# EAGLE design Remote_V1 (EAGLE 8.0.0)
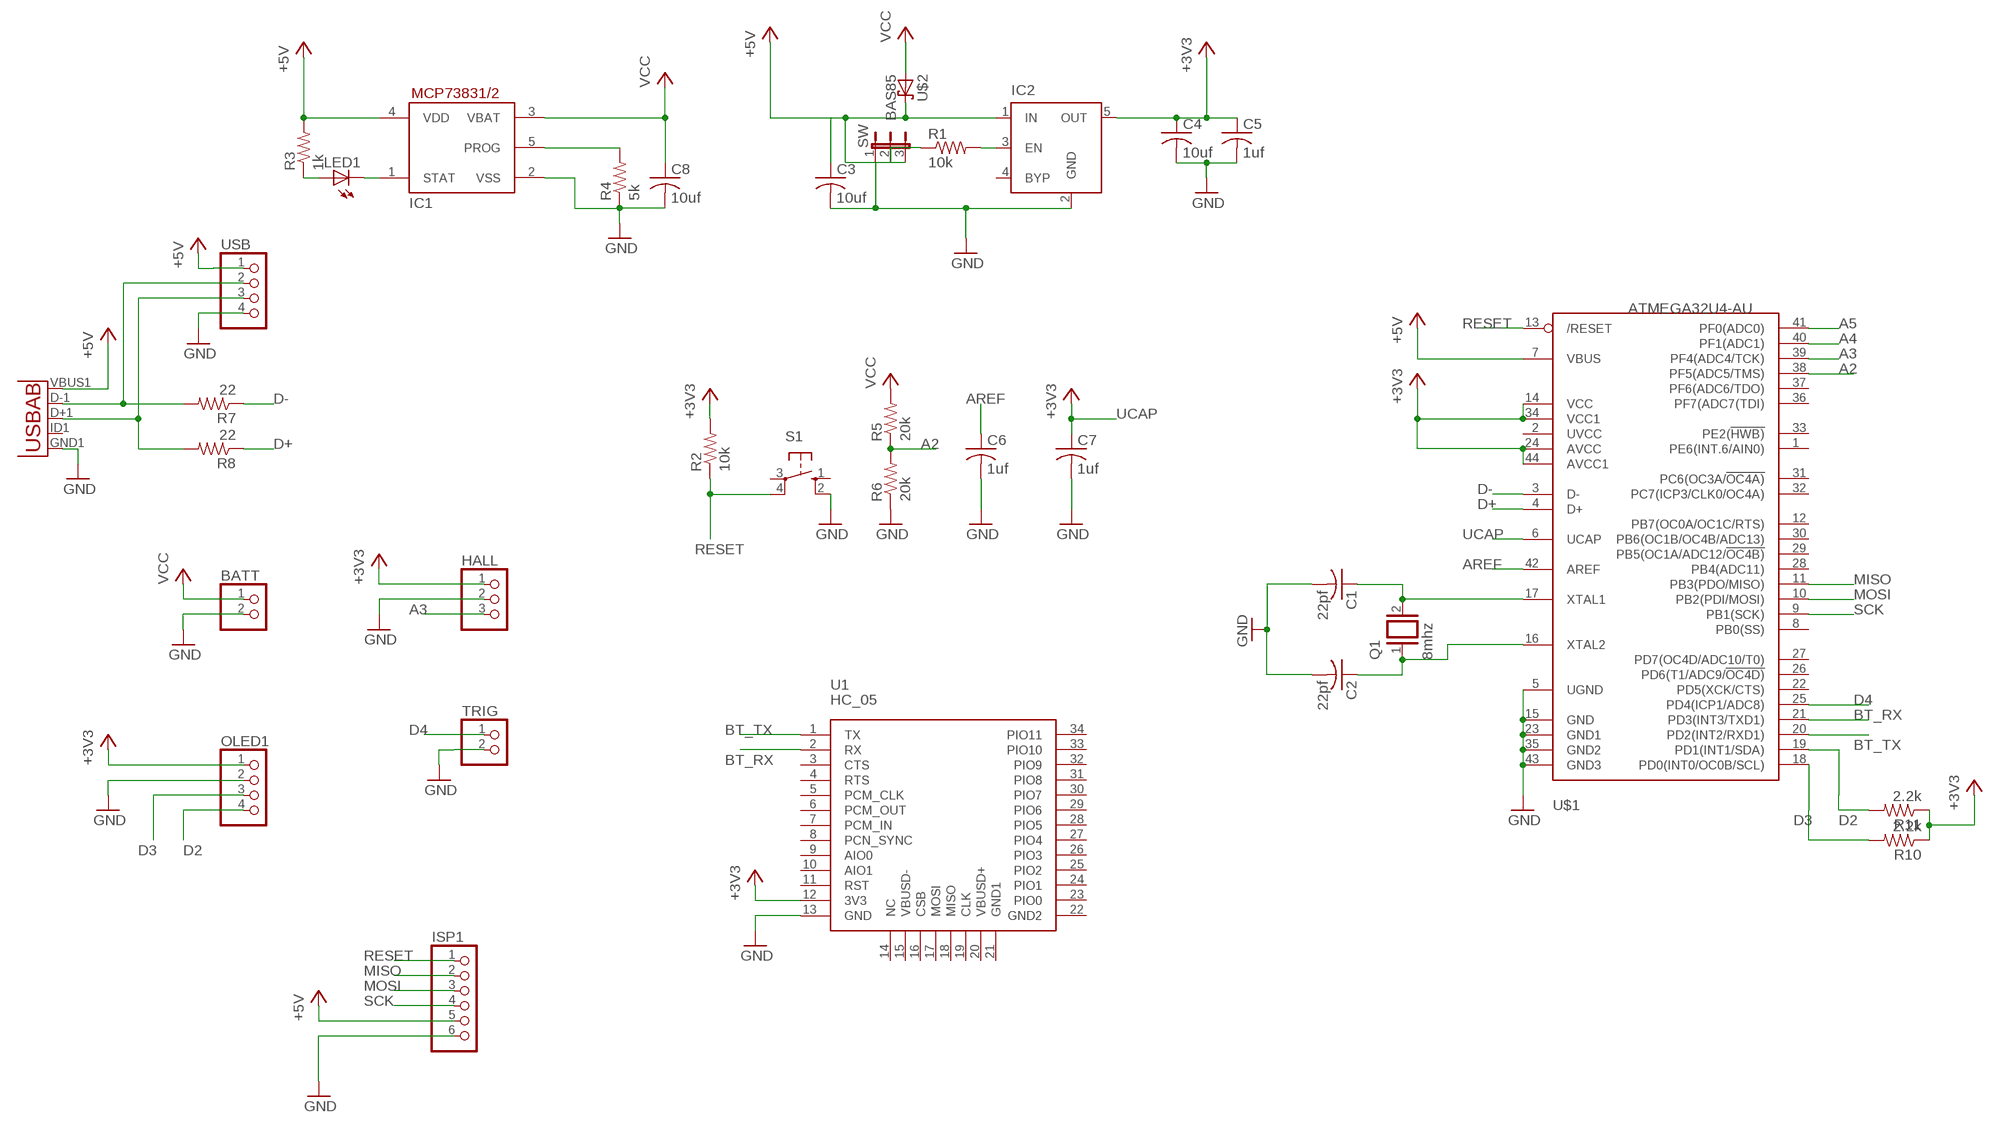
[diagram p0: schematic, sheet 1]

## Parts
BATT  PINHD-1X2  [1X02]
C1  22pf  C-US025-030X050  [C025-030X050]
C2  22pf  C-US025-030X050  [C025-030X050]
C3  10uf  C-USC0603  [C0603]
C4  10uf  C-USC0603  [C0603]
C5  1uf  C-USC0603  [C0603]
C6  1uf  C-USC0603  [C0603]
C7  1uf  C-USC0603  [C0603]
C8  10uf  C-USC0603  [C0603]
HALL  PINHD-1X3  [1X03]
IC1  MCP73831/OT  [SOT23-5L]
IC2  MIC5219XX  [SOT23-5]
ISP1  PINHD-1X6  [1X06]
LED1  LEDCHIPLED_0805  [CHIPLED_0805]
OLED1  PINHD-1X4  [1X04]
Q1  8mhz  XTAL/S  [QS]
R1  10k  R-US_R0603  [R0603]
R2  10k  R-US_R0603  [R0603]
R3  1k  R-US_R0603  [R0603]
R4  5k  R-US_R0603  [R0603]
R5  20k  R-US_R0603  [R0603]
R6  20k  R-US_R0603  [R0603]
R7  22  R-US_R0603  [R0603]
R8  22  R-US_R0603  [R0603]
R10  2.2k  R-US_R0603  [R0603]
R11  2.2k  R-US_R0603  [R0603]
S1  10-XX  [B3F-10XX]
SW  JP2E  [JP2]
TRIG  PINHD-1X2  [1X02]
U1  HC_05  [BLUETOOTH_SMD]
U2  USB""  [USB-MICRO-SMD]
U$1  ATMEGA32U4-AU  [TQFP44]
U$2  BAS85  [SOD80C]
USB  PINHD-1X4  [1X04]

## Nets
+3V3 [V3.3]: C4.1 C5.1 HALL.1 IC2.5(OUT) OLED1.1 R2.2 R10.1 R11.1 U1.12(3V3) U$1.14(VCC) U$1.24(AVCC) U$1.34(VCC1) U$1.44(AVCC1)
+5V [Vbus]: C3.1 IC1.4(VDD) IC2.1(IN) ISP1.5 R3.2 SW.3 U2.VBUS1(VBUS) U$1.7(VBUS) U$2.1(K) USB.1
A2: R5.1 R6.2 U$1.38(PF5(ADC5/TMS))
A3: HALL.3 U$1.39(PF4(ADC4/TCK))
A4: U$1.40(PF1(ADC1))
A5: U$1.41(PF0(ADC0))
AREF: C6.1 U$1.42(AREF)
BT_RX: U1.2(RX) U$1.21(PD3(INT3/TXD1))
BT_TX: U1.1(TX) U$1.20(PD2(INT2/RXD1))
D2: OLED1.4 R11.2 U$1.19(PD1(INT1/SDA))
D3: OLED1.3 R10.2 U$1.18(PD0(INT0/OC0B/SCL))
D4: TRIG.1 U$1.25(PD4(ICP1/ADC8))
D+: R8.1 U$1.4(D+)
D-: R7.1 U$1.3(D-)
GND [GND]: BATT.2 C1.2 C2.2 C3.2 C4.2 C5.2 C6.2 C7.2 C8.2 HALL.2 IC1.2(VSS) IC2.2(GND) ISP1.6 OLED1.2 R4.1 R6.1 S1.2(S1) SW.1 TRIG.2 U1.13(GND) U2.GND1(GND) U$1.5(UGND) U$1.15(GND) U$1.23(GND1) U$1.35(GND2) U$1.43(GND3) USB.4
MISO: ISP1.2 U$1.11(PB3(PDO/MISO))
MOSI: ISP1.3 U$1.10(PB2(PDI/MOSI))
N$1: C1.1 Q1.2 U$1.17(XTAL1)
N$2: C2.1 Q1.1 U$1.16(XTAL2)
N$3: R1.1 SW.2
N$4: IC2.3(EN) R1.2
N$5: LED1.A R3.1
N$6: IC1.1(STAT) LED1.C
N$7: IC1.5(PROG) R4.2
N$11: R7.2 U2.D-1(D-) USB.2
N$12: R8.2 U2.D+1(D+) USB.3
RESET: ISP1.1 R2.1 S1.4(P1) U$1.13(/RESET)
SCK: ISP1.4 U$1.9(PB1(SCK))
UCAP: C7.1 U$1.6(UCAP) ; supply symbol labelled +3V3
VCC [Vbat]: BATT.1 C8.1 IC1.3(VBAT) R5.2 U$2.2(A)
Unconnected: IC2.4(BYP) S1.1(S) S1.3(P) U1.3(CTS) U1.4(RTS) U1.5(PCM_CLK) U1.6(PCM_OUT) U1.7(PCM_IN) U1.8(PCN_SYNC) U1.9(AIO0) U1.10(AIO1) U1.11(RST) U1.14(NC) U1.15(VBUSD-) U1.16(CSB) U1.17(MOSI) U1.18(MISO) U1.19(CLK) U1.20(VBUSD+) U1.21(GND1) U1.22(GND2) U1.23(PIO0) U1.24(PIO1) U1.25(PIO2) U1.26(PIO3) U1.27(PIO4) U1.28(PIO5) U1.29(PIO6) U1.30(PIO7) U1.31(PIO8) U1.32(PIO9) U1.33(PIO10) U1.34(PIO11) U2.ID1(USBID) U$1.1(PE6(INT.6/AIN0)) U$1.2(UVCC) U$1.8(PB0(SS)) U$1.12(PB7(OC0A/OC1C/RTS)) U$1.22(PD5(XCK/CTS)) U$1.26(PD6(T1/ADC9/!OC4D)) U$1.27(PD7(OC4D/ADC10/T0)) U$1.28(PB4(ADC11)) U$1.29(PB5(OC1A/ADC12/!OC4B)) U$1.30(PB6(OC1B/OC4B/ADC13)) U$1.31(PC6(OC3A/!OC4A)) U$1.32(PC7(ICP3/CLK0/OC4A)) U$1.33(PE2(!HWB)) U$1.36(PF7(ADC7(TDI)) U$1.37(PF6(ADC6/TDO))

## Library data of the parts
BATT TRIG = pinhead:PINHD-1X2: PIN HEADER
C1-C8 = adafruit:C-US: CAPACITOR, American symbol
HALL = pinhead:PINHD-1X3: PIN HEADER
IC1 = adafruit:MCP73831: MCP73831/2 Miniature Single-Cell, Fully Integrated Li-Ion, Li-Polymer Charge Management Controllers. Nice and small simple lipoly charge controller, with adjustable current and status output (LED) http://www.ladyada.net/library/pcb/eaglelibrary.html
IC2 = v-reg-micrel:MIC5219XX: VOLTAGE REGULATOR; OC_FARNELL: unknown; OC_NEWARK: unknown
ISP1 = adafruit:PINHD-1X6: PIN HEADER
LED1 = adafruit:LED: LED OSRAM: - CHIPLED LG R971, LG N971, LY N971, LG Q971, LY Q971, LO R971, LY R971 LH N974, LH R974 LS Q976, LO Q976, LY Q976 LO Q996 - Hyper CHIPLED LW Q18S LB Q993, LB Q99A, LB R99A - SideLED LS A670, LO A670, LY A670, LG A670, LP A670 LB A673, LV A673, LT A673, LW A673 LH A674 LY A675 LS A676, LA A676, LO A676, LY A676, LW A676 LS A679, LY A679, LG A679 - Hyper Micro SIDELED® LS Y876, LA Y876, LO Y876, LY Y876 LT Y87S - SmartLED LW L88C, LW L88S LB L89C, LB L89S, LG L890 LS L89K, LO L89K, LY L89K LS L896, LA L896, LO L896, LY L896 - TOPLED LS T670, LO T670, LY T670, LG T670, LP T670 LSG T670, LSP T670, LSY T670, LOP T670, LYG T670 LG T671, LOG T671, LSG T671 LB T673, LV T673, LT T673, LW T673 LH T674 LS T676, LA T676, LO T676, LY T676, LB T676, LH T676, LSB T676, LW T676 LB T67C, LV T67C, LT T67C, LS T67K, LO T67K, LY T67K, LW E67C LS E67B, LA E67B, LO E67B, LY E67B, LB E67C, LV E67C, LT E67C LW T67C LS T679, LY T679, LG T679 LS T770, LO T770, LY T770, LG T770, LP T770 LB T773, LV T773, LT T773, LW T773 LH T774 LS E675, LA E675, LY E675, LS T675 LS T776, LA T776, LO T776, LY T776, LB T776 LHGB T686 LT T68C, LB T68C - Hyper Mini TOPLED® LB M676 - Mini TOPLED Santana® LG M470 LS M47K, LO M47K, LY M47K Source: http://www.osram.convergy.de/
OLED1 USB = pinhead:PINHD-1X4: PIN HEADER
Q1 = special:XTAL/S: CRYSTAL
R1-R8 R10 R11 = resistor:R-US_: RESISTOR, American symbol
S1 = switch-omron:10-XX: OMRON SWITCH; MPN: B3F-1000; OC_FARNELL: 176432; OC_NEWARK: 36M3542
SW = jumper:JP2E: JUMPER
U1 = SparkFun-RF:HC_05: HC-05 Bluetooth Module
U2 = microUSB:USB: This is a USB AB connector that is compatible with USB OTG. i.e. this connector can serve as a host or device
U$1 = adafruit:ATMEGA32U4: http://www.ladyada.net/library/eagle
U$2 = nxp_60:BAS85: Schottky barrier diode Planar Schottky barrier diode with an integrated guard ring for stress protection, encapsulated in a small hermetically sealed glass SOD80C Surface-Mounted Device SMD package with tin-plated metal discs at each end. It is suitable for ?automatic placement? and as such it can withstand immersion soldering. AAL Eindhoven MK

## Net classes
1 Vbus: width 0.508 mm
2 Vbat: width 0.508 mm
3 V3.3: width 0.508 mm
4 GND: width 0.508 mm

## Board
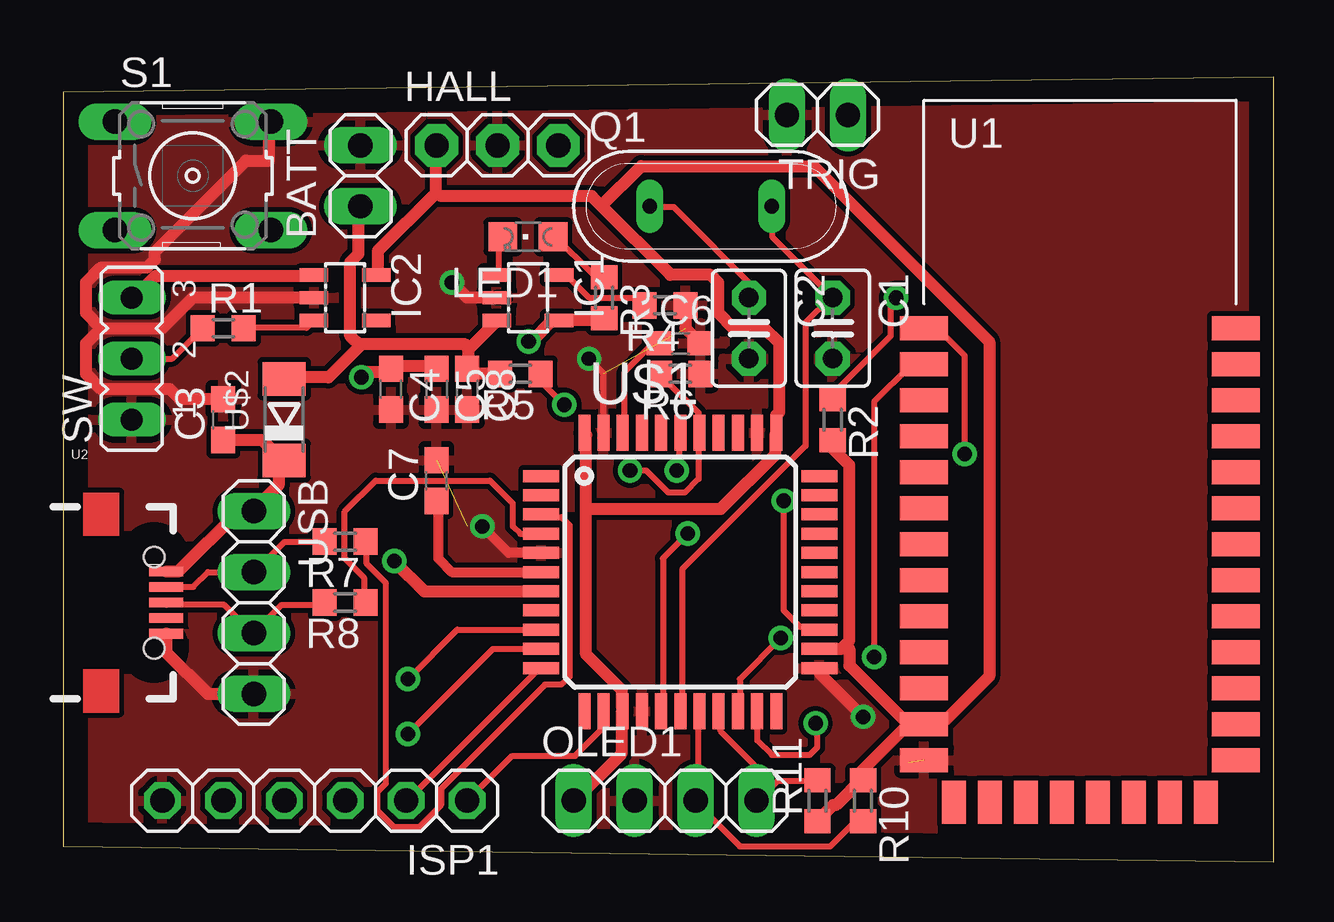
[diagram p1: board, top side]
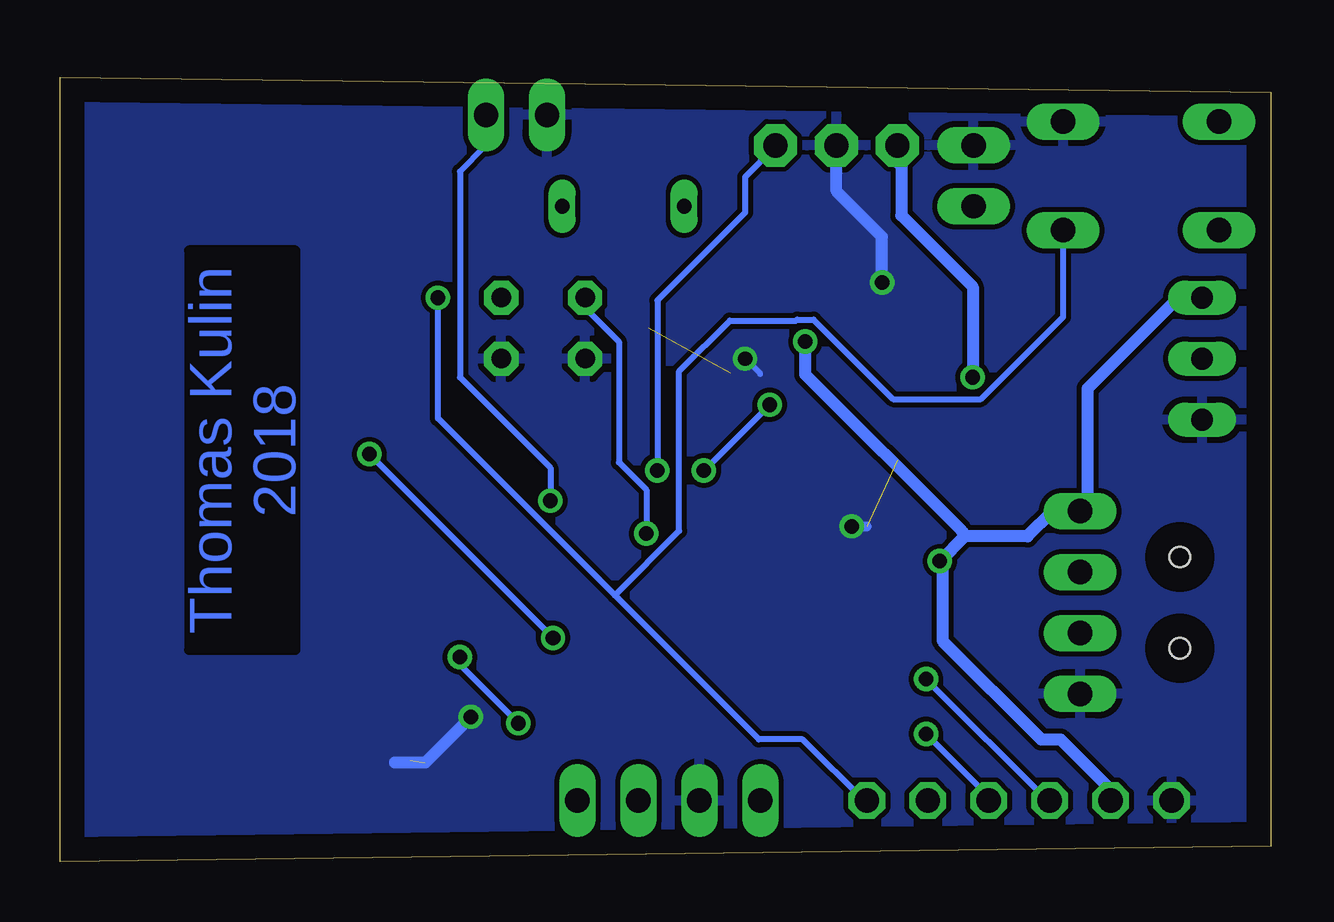
[diagram p2: board, bottom side, seen from below]

Size 50.46 x 32.69 mm. Coordinates in mm from the lower left corner, seen from the top.
Outline: 0,0.64 50.46,0 50.46,32.69 0,32.05 0,0.64
Copper layers (1*16): Top 0.035mm / dielectric 1.5mm / Bottom 0.035mm
Design rules "default": minimum track width 10mil, minimum drill 24mil, track to track 8mil, track to pad 8mil, pad to pad 8mil, via to via 8mil, smd to smd 8mil, copper to edge 40mil, drill to drill 8mil, minimum pad ring 10mil, minimum via ring 8mil, stop-mask expansion 4mil, vias tented up to drill 0mil, thermal gap 10mil

### Footprints (pad centres in the part's own frame; a part is rotated, then mirrored left to right if it is on the bottom)
1X02 = drill 1.016 long: 1 -1.27,0; 2 1.27,0
C025-030X050 = drill 0.813 pad 1.422 octagon: 1 -1.27,0; 2 1.27,0
C0603 = smd 1.1 x 1: 1 -0.85,0; 2 0.85,0
1X03 = drill 1.016 pad 1.778 octagon: 1 -2.54,0; 2 0,0; 3 2.54,0
SOT23-5L = smd 0.55 x 1.2: 1 -0.95,-1.3; 2 0,-1.3; 3 0.95,-1.3; 4 0.95,1.3; 5 -0.95,1.3
SOT23-5 = smd 0.55 x 1.2: 1 -0.95,-1.3; 2 0,-1.3; 3 0.95,-1.3; 4 0.95,1.3; 5 -0.95,1.3
1X06 = drill 1.016 octagon: 1 -6.35,0; 2 -3.81,0; 3 -1.27,0; 4 1.27,0; 5 3.81,0; 6 6.35,0
CHIPLED_0805 = smd 1.2 x 1.2: A 0,-1.05; C 0,1.05
1X04 = drill 1.016 long: 1 -3.81,0; 2 -1.27,0; 3 1.27,0; 4 3.81,0
QS = drill 0.61 long: 1 -2.54,0; 2 2.54,0
R0603 = smd 1 x 1.1: 1 -0.85,0; 2 0.85,0
B3F-10XX = drill 1.016 long: 1 -3.251,2.261; 2 3.251,2.261; 3 -3.251,-2.261; 4 3.251,-2.261
JP2 = drill 0.914 long: 1 -2.54,0; 2 0,0; 3 2.54,0
BLUETOOTH_SMD = smd 2 x 1: 1 -6.35,3.81; 2 -6.35,2.31; 3 -6.35,0.81; 4 -6.35,-0.69; 5 -6.35,-2.19; 6 -6.35,-3.69; 7 -6.35,-5.19; 8 -6.35,-6.69; 9 -6.35,-8.19; 10 -6.35,-9.69; 11 -6.35,-11.19; 12 -6.35,-12.69; 13 -6.35,-14.19; 22 6.65,-14.19; 23 6.65,-12.69; 24 6.65,-11.19; 25 6.65,-9.69; 26 6.65,-8.19; 27 6.65,-6.69; 28 6.65,-5.19; 29 6.65,-3.69; 30 6.65,-2.19; 31 6.65,-0.69; 32 6.65,0.81; 33 6.65,2.31; 34 6.65,3.81 | smd 1 x 1.8: 14 -5.1,-15.94; 15 -3.6,-15.94; 16 -2.1,-15.94; 17 -0.6,-15.94; 18 0.9,-15.94; 19 2.4,-15.94; 20 3.9,-15.94; 21 5.4,-15.94
USB-MICRO-SMD = smd 1.4 x 0.4: D+1 2.7,0; D-1 2.7,0.65; GND1 2.7,-1.3; ID1 2.7,-0.65; VBUS1 2.7,1.3 | hole 0.85: 2.2,1.9; 2.2,-1.9
TQFP44 = smd 1.5 x 0.5: 1 -5.8,4; 2 -5.8,3.2; 3 -5.8,2.4; 4 -5.8,1.6; 5 -5.8,0.8; 6 -5.8,0; 7 -5.8,-0.8; 8 -5.8,-1.6; 9 -5.8,-2.4; 10 -5.8,-3.2; 11 -5.8,-4; 23 5.8,-4; 24 5.8,-3.2; 25 5.8,-2.4; 26 5.8,-1.6; 27 5.8,-0.8; 28 5.8,0; 29 5.8,0.8; 30 5.8,1.6; 31 5.8,2.4; 32 5.8,3.2; 33 5.8,4 | smd 0.5 x 1.5: 12 -4,-5.8; 13 -3.2,-5.8; 14 -2.4,-5.8; 15 -1.6,-5.8; 16 -0.8,-5.8; 17 0,-5.8; 18 0.8,-5.8; 19 1.6,-5.8; 20 2.4,-5.8; 21 3.2,-5.8; 22 4,-5.8; 34 4,5.8; 35 3.2,5.8; 36 2.4,5.8; 37 1.6,5.8; 38 0.8,5.8; 39 0,5.8; 40 -0.8,5.8; 41 -1.6,5.8; 42 -2.4,5.8; 43 -3.2,5.8; 44 -4,5.8
SOD80C = smd 1.4 x 1.8: 1 -1.7,0; 2 1.7,0

### Placement (x,y rotation side)
BATT  12.38,28.57 90 top
C1  32.07,22.23 270 top
C2  28.57,22.23 270 top
C3  6.67,18.41 90 top
C4  13.65,19.68 270 top
C5  15.56,19.68 270 top
C6  25.72,21.59 0 top
C7  15.56,15.88 90 top
C8  16.83,19.68 270 top
HALL  18.1,29.84 0 top
IC1  19.37,23.5 270 top
IC2  11.75,23.5 270 top
ISP1  10.48,2.54 180 top
LED1  19.37,26.04 90 top
OLED1  25.08,2.54 0 top
Q1  26.99,27.3 0 top
R1  6.67,22.23 0 top
R2  32.07,18.41 270 top
R3  22.54,23.5 270 top
R4  25.08,23.18 180 top
R5  19.05,20.32 180 top
R6  25.72,20.32 180 top
R7  11.75,13.34 180 top
R8  11.75,10.79 180 top
R10  33.34,2.54 270 top
R11  31.43,2.54 90 top
S1  5.4,28.57 0 top
SW  2.86,20.95 90 top
TRIG  31.43,31.11 180 top
U1  42.23,18.41 0 top
U2  1.59,10.79 0 top
U$1  25.72,12.06 0 top
U$2  9.21,18.41 90 top
USB  7.94,10.79 270 top

### Tracks (layer width: path | path; a pad name or v marks a point on that pad's centre or on a via)
+3V3  (via drill 0.61)
  Top 0.508: R11.1 31.51,1.78 32.08,2.35 32.19,2.35 33.34,3.49 R10.1 33.22,3.72 35.17,5.66 35.85,5.66 U1.12 | 32.59,9.04 32.42,8.87 31.62,8.87 U$1.24 | 32.59,9.04 32.77,9.21 32.77,16.52 32.08,17.21 R2.2 | U1.12 35.05,5.89 32.77,8.18 32.77,8.87 32.59,9.04 | C5.1 15.51,20.64 13.68,20.64 C4.1 13.45,20.41 12.65,20.41 v12.42,20.18 | 15.51,27.84 13.11,25.44 13.11,24.52 IC2.5 | 15.51,27.84 15.51,29.78 HALL.1 | OLED1.1 21.34,2.58 23.28,4.52 23.28,6.24 U$1.14 23.28,6.46 23.28,7.15 21.79,8.64 21.79,14.69 | 21.79,14.69 21.79,17.78 U$1.44 | 21.79,14.69 27.39,14.69 29.68,16.98 29.68,17.78 U$1.34 29.72,18.61 29.84,18.73 29.84,21.59 29.21,22.23 27.94,22.23 27.3,22.86 27.3,24.13 26.99,24.45 25.3,24.45 22.42,27.32 | 22.42,27.32 22.02,27.72 15.73,27.72 15.51,27.84 | 22.42,27.32 24.08,28.98 31.28,28.98 38.59,21.67 38.59,7.72 36.77,5.89 36.08,5.89 U1.12
  Bottom 0.508: v12.42,20.18 12.42,23.95 15.39,26.92 15.39,28.98 15.51,29.1 15.51,29.78 HALL.1
+5V  (via drill 0.61)
  Top 0.508: IC2.1 10.36,24.41 3.85,24.41 2.93,23.5 SW.3 | C3.1 6.71,17.55 8.31,17.55 9.11,16.75 U$2.1 8.99,16.52 8.99,15.72 7.96,14.69 USB.1 7.3,14.61 4.79,12.1 U2.VBUS1 | R3.2 22.48,22.58 20.77,22.58 IC1.4 20.42,22.58 19.51,21.67 v19.39,21.67 | v13.79,12.52 15.05,11.27 19.85,11.27 U$1.7
  Bottom 0.508: 12.76,13.55 v13.79,12.52 13.68,12.29 13.68,9.21 9.56,5.09 8.76,5.09 6.71,3.04 6.71,2.58 ISP1.5 | 12.76,13.55 10.13,13.55 9.11,14.58 7.96,14.58 USB.1 7.85,14.81 7.62,15.04 7.62,19.72 3.85,23.5 SW.3 | v19.39,21.67 19.39,20.3 12.88,13.78 12.76,13.55
A2  (via drill 0.61)
  Top 0.254: v23.62,16.29 24.31,16.29 25.22,15.38 25.91,15.38 26.48,15.95 26.48,17.78 U$1.38 26.48,17.89 26.48,18.69 24.88,20.3 R6.2 | R5.1 19.9,20.02 v20.88,19.04
  Bottom 0.254: v23.62,16.29 v20.88,19.04
A3  (via drill 0.61)
  Top 0.254: v25.57,16.29 25.68,16.41 25.68,17.78 U$1.39
  Bottom 0.254: v25.57,16.29 25.57,23.38 21.91,27.04 21.91,28.52 20.65,29.78 HALL.3
AREF
  Top 0.254: C6.1 24.77,21.55 24.54,21.55 23.39,20.41 23.39,17.89 U$1.42
BT_RX  (via drill 0.61)
  Top 0.254: v33.8,8.52 33.8,19.15 35.28,20.64 35.85,20.64 U1.2 | 28.99,6.35 U$1.21 28.92,5.05 29.53,4.45 31.11,4.45 31.43,4.76 31.43,5.69 v31.36,5.77
  Bottom 0.254: v33.8,8.52 33.8,8.2 v31.36,5.77
BT_TX  (via drill 0.61)
  Top 0.254: v29.91,9.32 28.19,7.61 28.19,6.35 U$1.20 | v37.57,16.98 37.57,21.09 36.54,22.12 35.97,22.12 U1.1
  Bottom 0.254: v37.57,16.98 v29.91,9.32
D2
  Top 0.254: R11.2 31.39,3.38 29.79,3.38 28.99,2.58 OLED1.4 29.57,3.26 27.39,5.44 27.39,6.24 U$1.19
D3
  Top 0.254: R10.2 33.34,1.66 32.99,1.66 31.97,0.64 28.19,0.64 26.36,2.46 OLED1.3 26.48,2.46 26.48,6.24 U$1.18
D4  (via drill 0.61)
  Top 0.254: v30.02,15.04 30.02,10.46 30.71,9.78 31.51,9.78 U$1.25
  Bottom 0.254: v30.02,15.04 30.02,16.41 33.8,20.18 33.8,28.75 32.77,29.78 32.77,31.04 TRIG.1
D+
  Top 0.254: R8.1 12.54,10.81 12.54,11.84 11.73,12.64 11.73,14.59 13.02,15.88 17.78,15.88 18.73,14.92 18.73,13.97 19.05,13.65 19.91,13.65 U$1.4 19.85,13.66
D-
  Top 0.254: R7.1 12.65,13.32 12.65,12.41 13.45,11.61 13.45,3.26 13.11,2.92 13.11,2.12 13.79,1.44 14.82,1.44 15.73,2.35 15.73,3.04 20.08,7.38 20.77,7.38 21.11,7.72 21.11,14.01 20.77,14.35 19.96,14.35 U$1.3
GND  (via drill 0.6)  (3 unrouted)
  Top 0.254: U$1.43 22.52,20.34 v21.91,20.95
  Top 0.406: U$1.5 18.57,12.87 v17.46,13.97
  Top 0.508: R4.1 25.93,22.23 C6.2 | U2.GND1 4.29,8.73 6.03,6.99 USB.4 | IC1.2 16.83,23.5 v16.19,24.13 | U$1.23 31.52,7.85 v33.34,6.03 | IC2.2 5.4,23.5 4.13,22.23 1.59,22.23 | 1.59,22.23 0.95,22.86 0.95,24.13 1.59,24.77 3.49,24.77 3.81,25.08 3.81,25.4 7.62,29.21 8.57,29.21 8.57,30.76 S1.2 | C3.2 4.87,19.27 4.45,19.68 1.59,19.68 0.95,20.32 0.95,21.59 1.59,22.23
  Bottom 0.254: v21.91,20.95 21.27,20.32
  Bottom 0.406: v17.46,13.97 16.83,13.97
  Bottom 0.508: v16.19,24.13 16.19,26.04 18.1,27.94 HALL.2 | v33.34,6.03 35.24,4.13 36.51,4.13
  pour Top: -3.49,33.66 68.9,33.97 68.9,-2.86 -3.49,-3.17
  pour Bottom: -6.03,33.97 68.9,33.97 68.9,-2.86 -6.03,-2.86
MISO
  Top 0.254: U$1.11 19.85,8.06 14.36,2.58 ISP1.2
MOSI  (via drill 0.61)
  Top 0.254: v14.36,5.32 17.91,8.87 19.85,8.87 U$1.10
  Bottom 0.254: v14.36,5.32 11.85,2.81 11.85,2.58 ISP1.3
N$1
  Top 0.254: U$1.17 25.79,6.35 25.79,12.18 30.94,17.32 30.94,22.47 31.97,23.5 C1.1 31.97,23.61 29.57,26.01 29.57,27.27 Q1.2
N$2  (via drill 0.61)
  Top 0.254: v26.02,13.66 24.99,12.64 24.99,6.35 U$1.16 | Q1.1 24.54,27.27 25.45,27.27 28.88,23.84 28.88,23.5 C2.1
  Bottom 0.254: v26.02,13.66 26.02,15.49 27.16,16.64 27.16,21.67 28.99,23.5 C2.1
N$3
  Top 0.254: 5.79,22.12 R1.1 4.55,20.95 SW.2 2.93,20.98
N$4
  Top 0.254: R1.2 7.62,22.24 10.13,22.24 10.36,22.47 IC2.3
N$5
  Top 0.254: R3.1 22.48,24.41 22.14,24.41 20.42,26.12 LED1.A
N$6
  Top 0.254: IC1.1 18.14,24.52 18.14,25.89 18.25,26.01 LED1.C
N$7
  Top 0.254: 20.77,24.41 IC1.5 20.96,24.45 21.91,23.5 23.91,23.5 R4.2
N$8
  Top 0.254: 18.41,23.5 18.1,23.5
N$11
  Top 0.254: R7.2 10.82,13.32 9.22,13.32 7.96,12.06 USB.2 6.03,12.06 5.41,11.45 U2.D-1
N$12
  Top 0.254: R8.2 10.82,10.69 9.11,10.69 USB.3 7.85,9.55 6.71,10.69 4.3,10.69 U2.D+1
RESET  (via drill 0.61)
  Top 0.254: v34.71,23.5 34.48,23.27 34.48,21.89 32.08,19.49 R2.1 | U$1.13 22.48,6.24 22.48,5.55 21.34,4.41 18.71,4.41 16.88,2.58 ISP1.1
  Bottom 0.254: v34.71,23.5 34.71,18.47 27.34,11.09 | 27.34,11.09 21.34,5.09 19.51,5.09 16.88,2.46 ISP1.1 | S1.4 8.65,22.7 12.08,19.27 15.73,19.27 19.05,22.58 19.74,22.58 19.77,22.54 22.54,22.54 24.65,20.43 24.65,13.78 27.34,11.09
SCK  (via drill 0.61)
  Top 0.254: v14.36,7.61 16.42,9.66 19.85,9.66 U$1.9
  Bottom 0.254: v14.36,7.61 9.22,2.46 ISP1.4
UCAP
  Top 0.254: C7.1 15.62,14.92
  Top 0.406: 15.62,14.92 15.62,12.64 16.19,12.06 U$1.6
VCC
  Top 0.508: 16.88,21.32 16.88,20.64 C8.1 | 16.88,21.32 18.02,22.47 IC1.3 | 16.99,20.41 C8.1 | 12.36,21.5 12.42,21.55 16.76,21.55 16.88,21.32 | 12.36,21.5 11.05,20.18 9.22,20.18 U$2.2 | 12.36,21.5 11.96,21.89 11.96,24.98 12.31,25.32 12.31,27.27 BATT.1 | R5.2 17.04,20.32 C8.1

### Text on the board
Bottom: Thomas Kulin / 2018